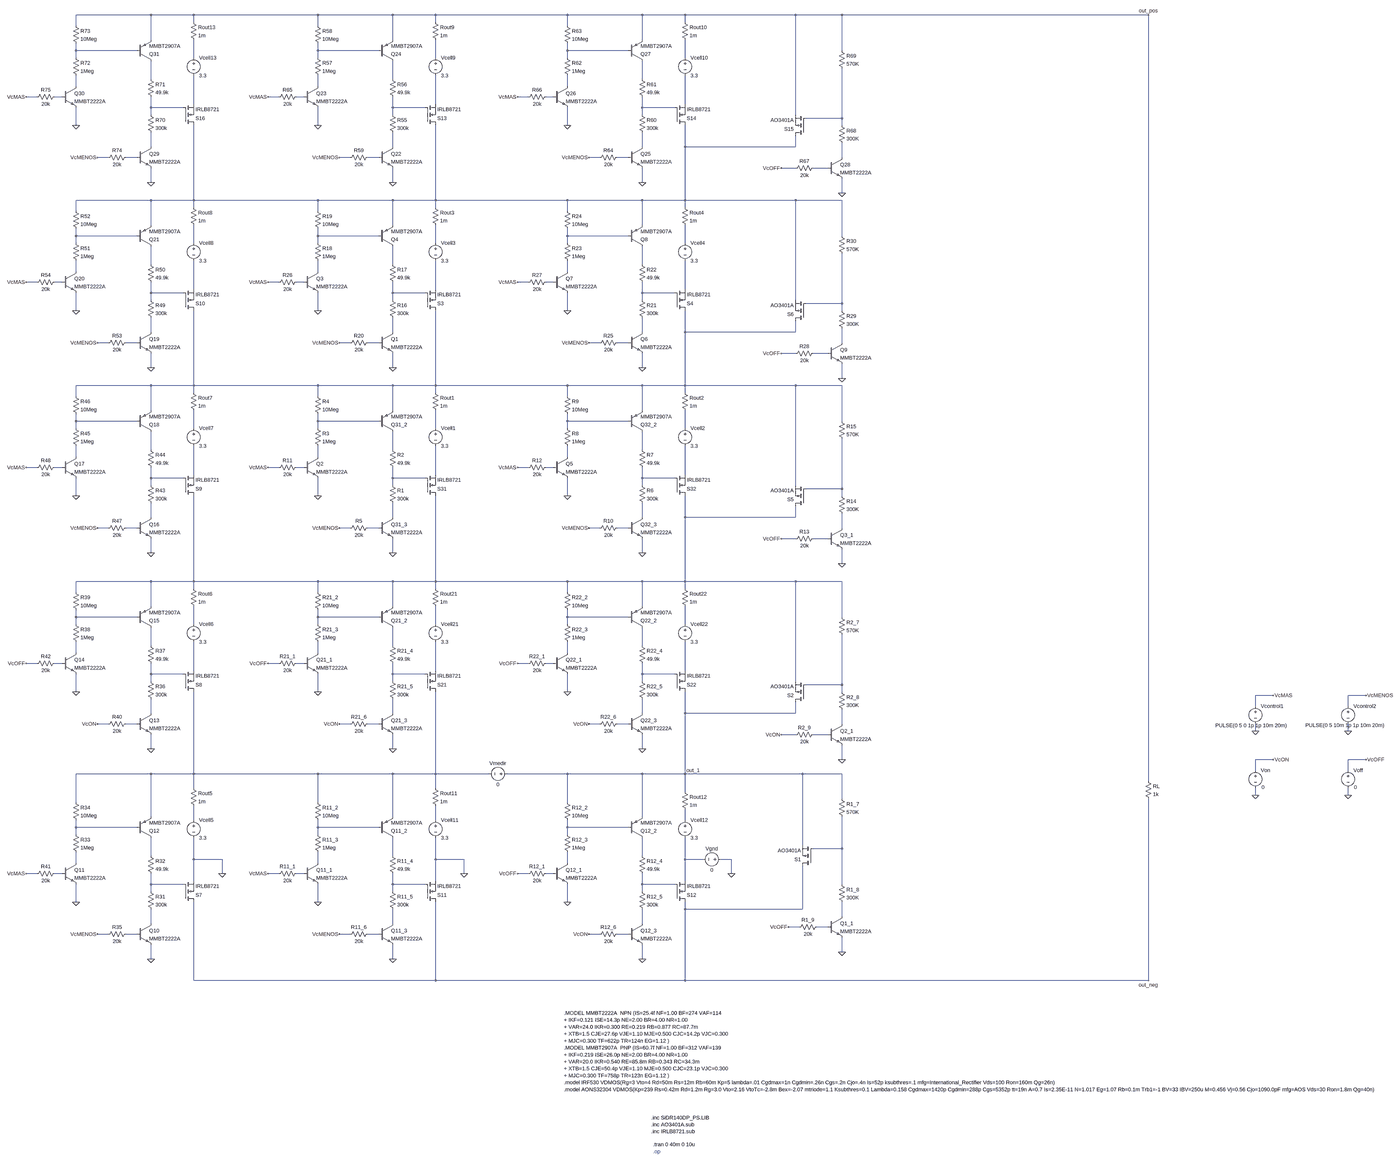
[diagram p0: schematic pruebas_de_cantidad.asc, whole sheet]
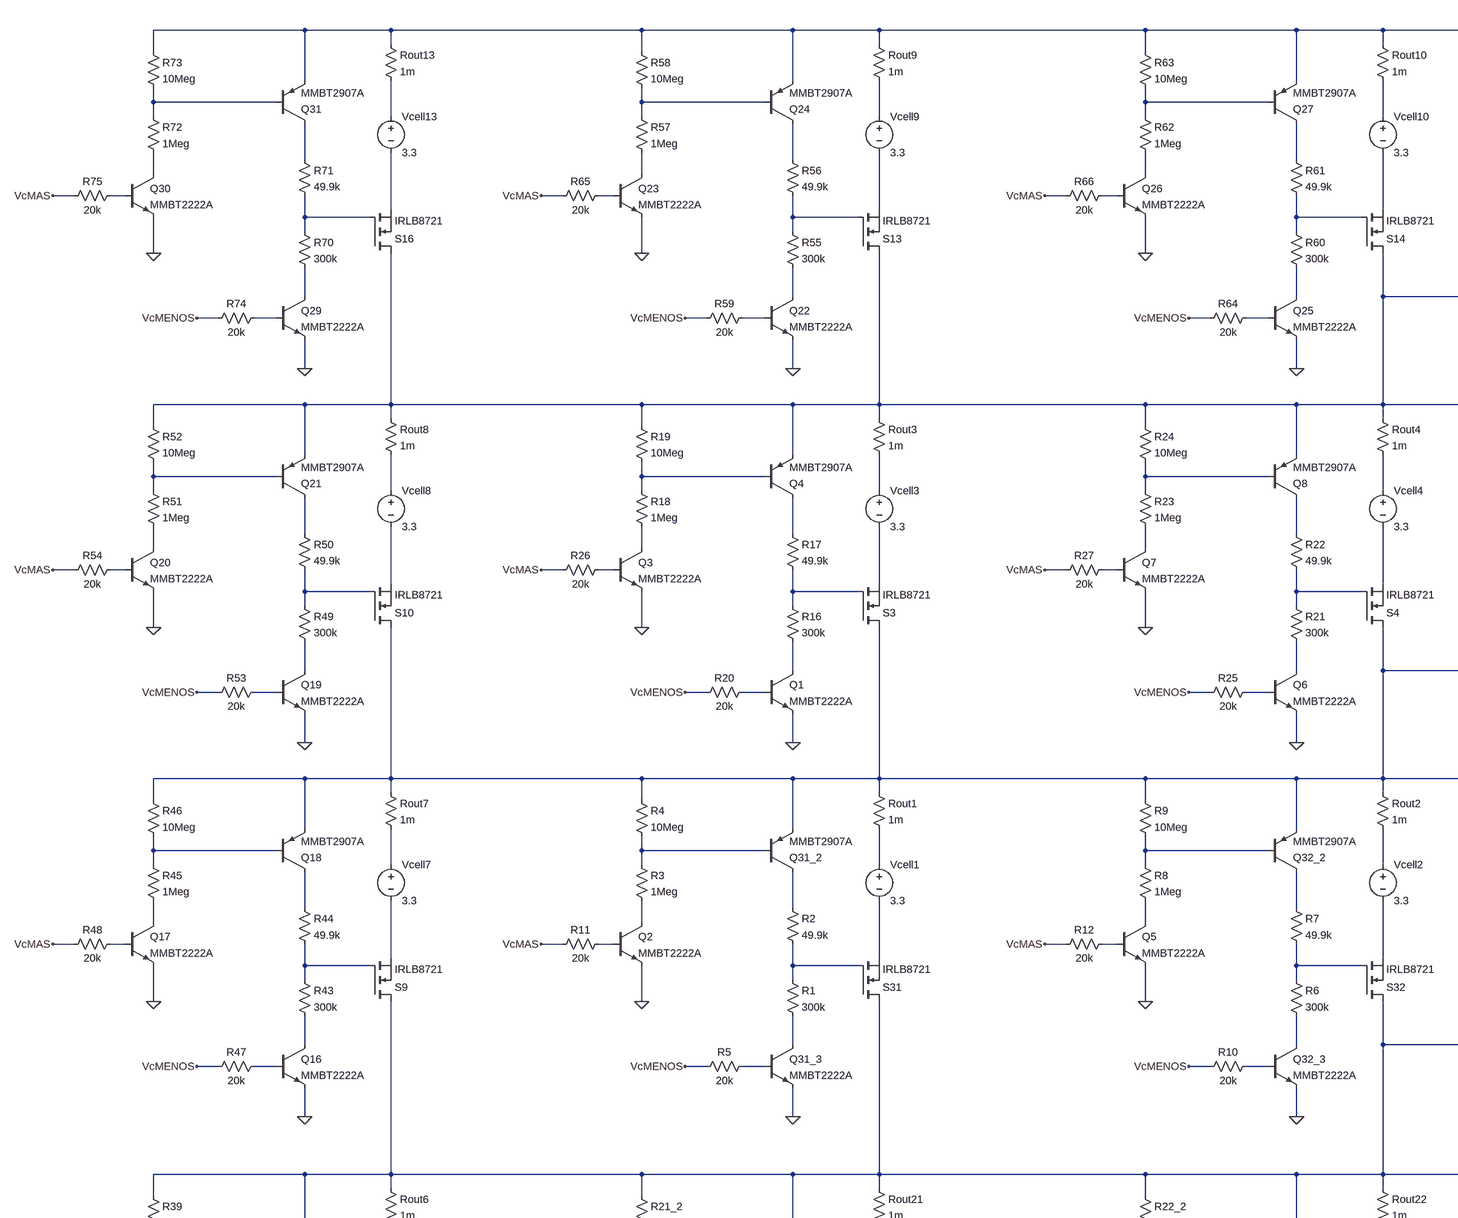
[diagram p1: schematic pruebas_de_cantidad.asc, part, row 1 of 2, column 1 of 2]
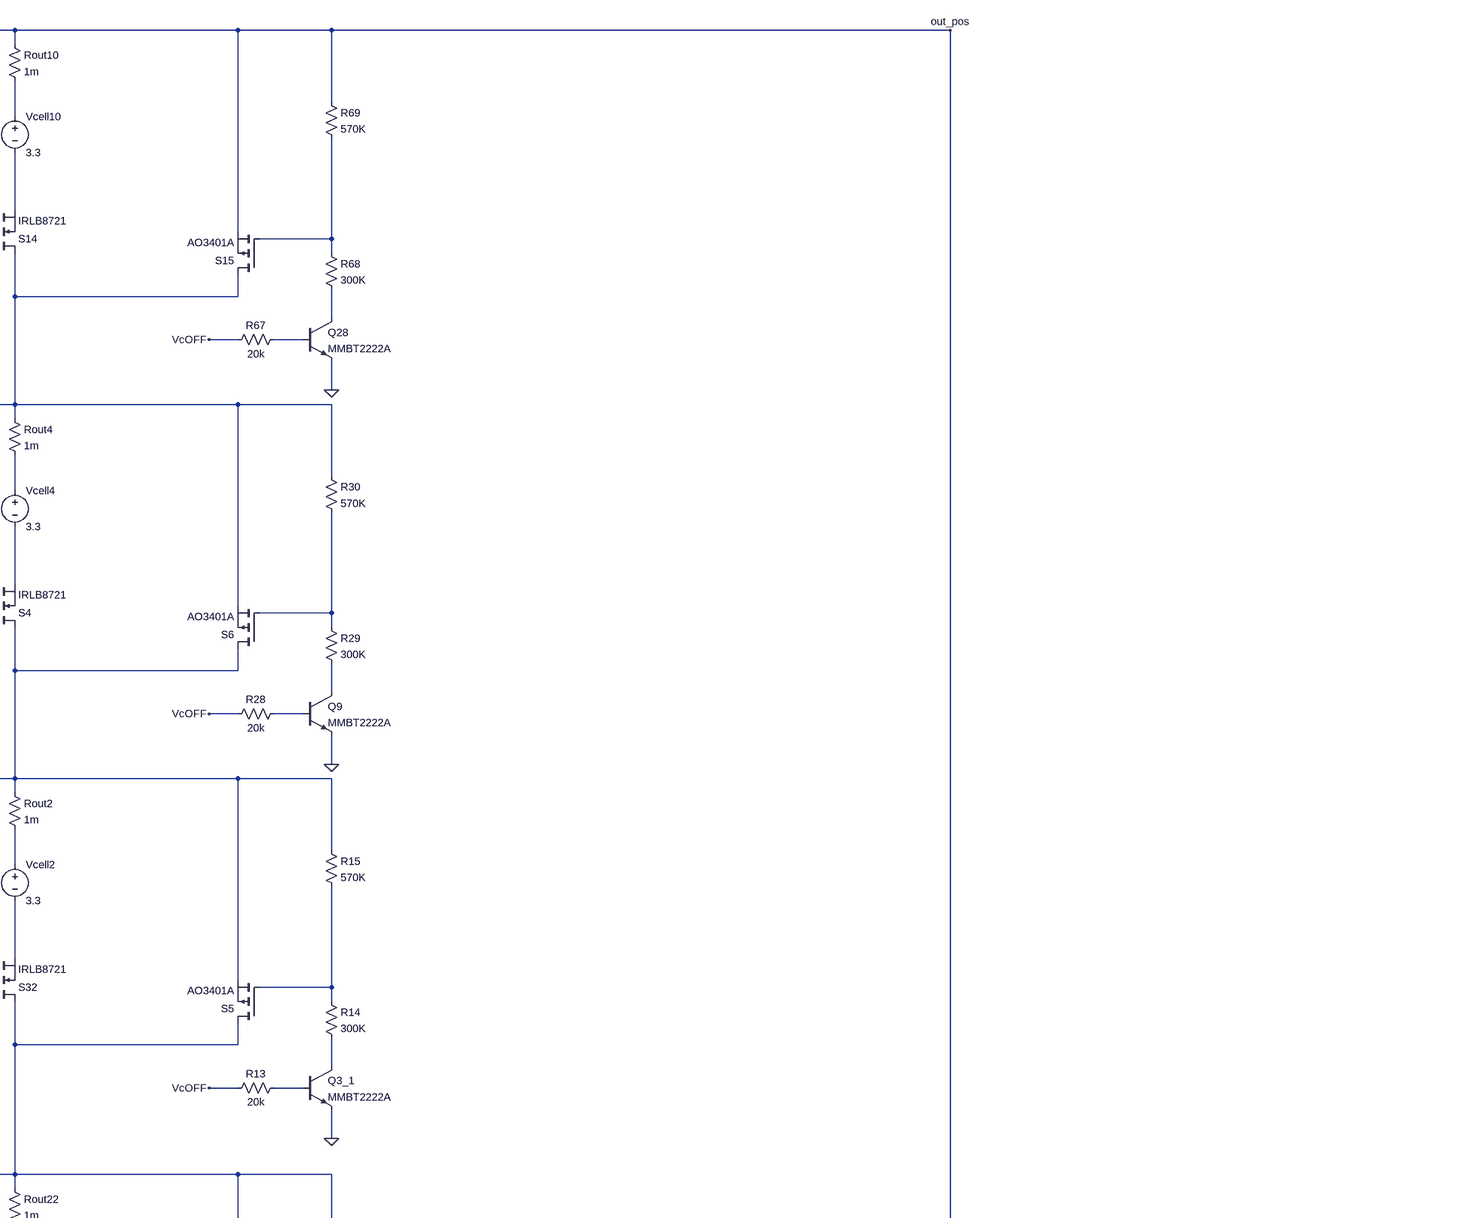
[diagram p2: schematic pruebas_de_cantidad.asc, part, row 1 of 2, column 2 of 2]
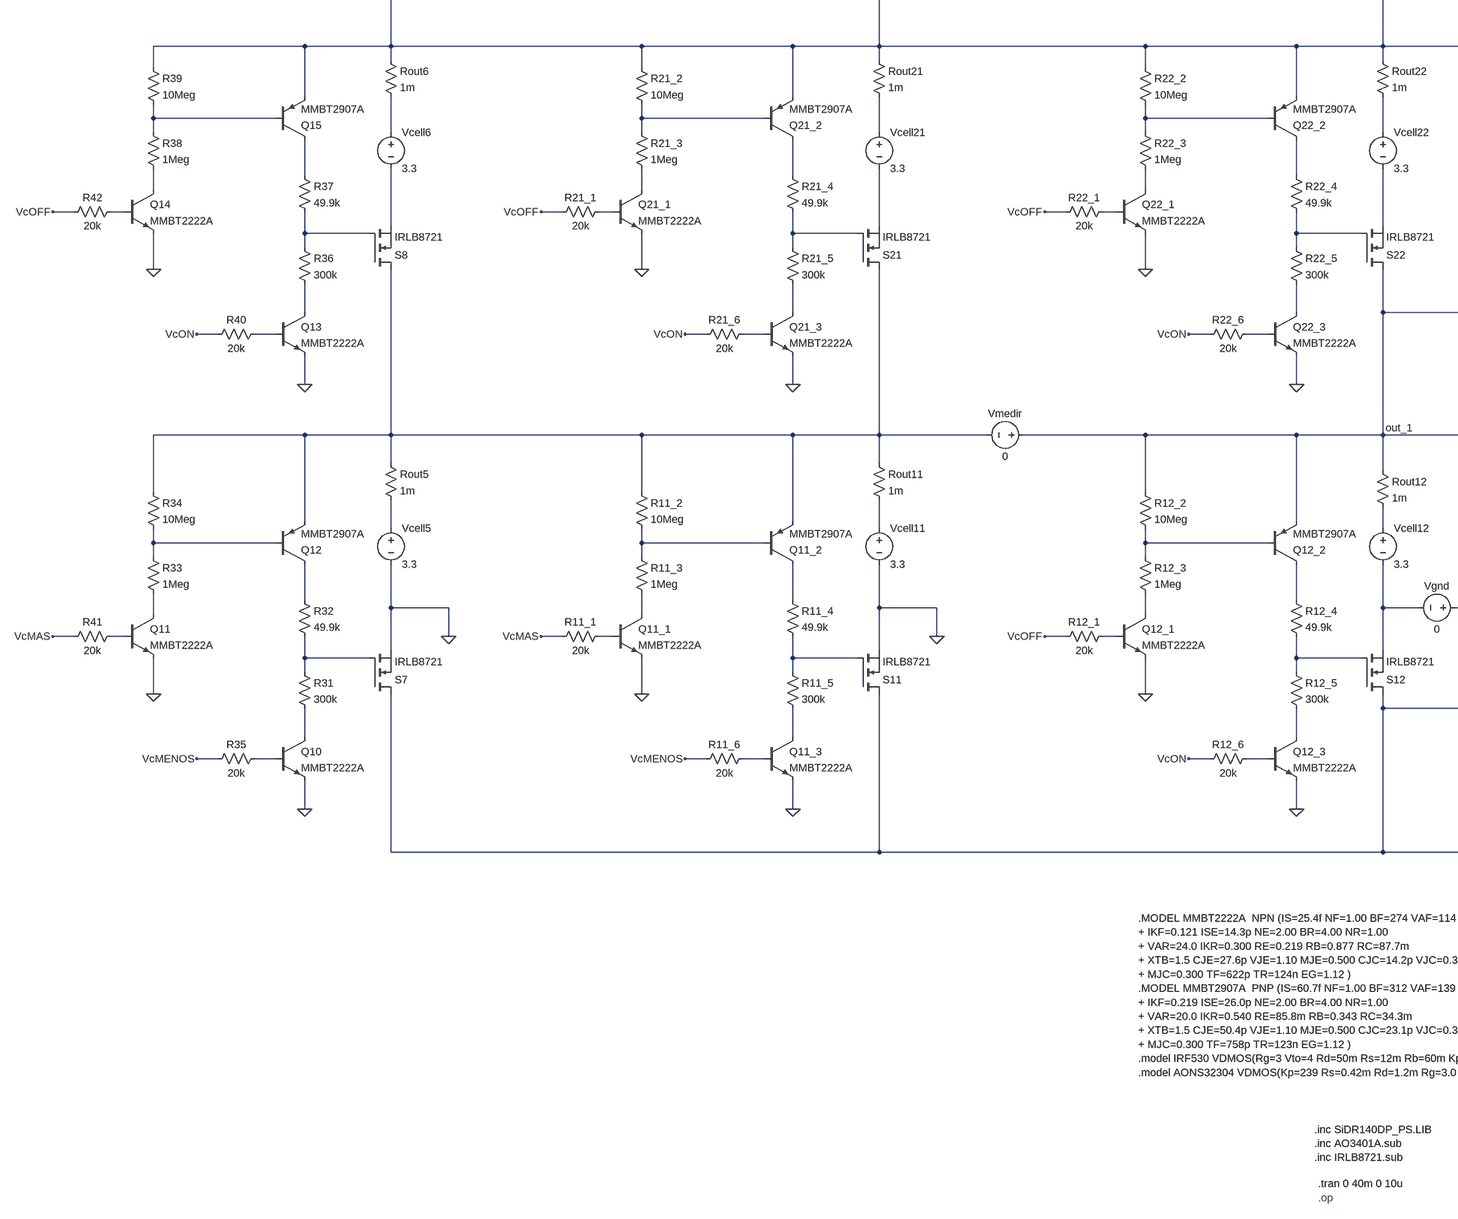
[diagram p3: schematic pruebas_de_cantidad.asc, part, row 2 of 2, column 1 of 2]
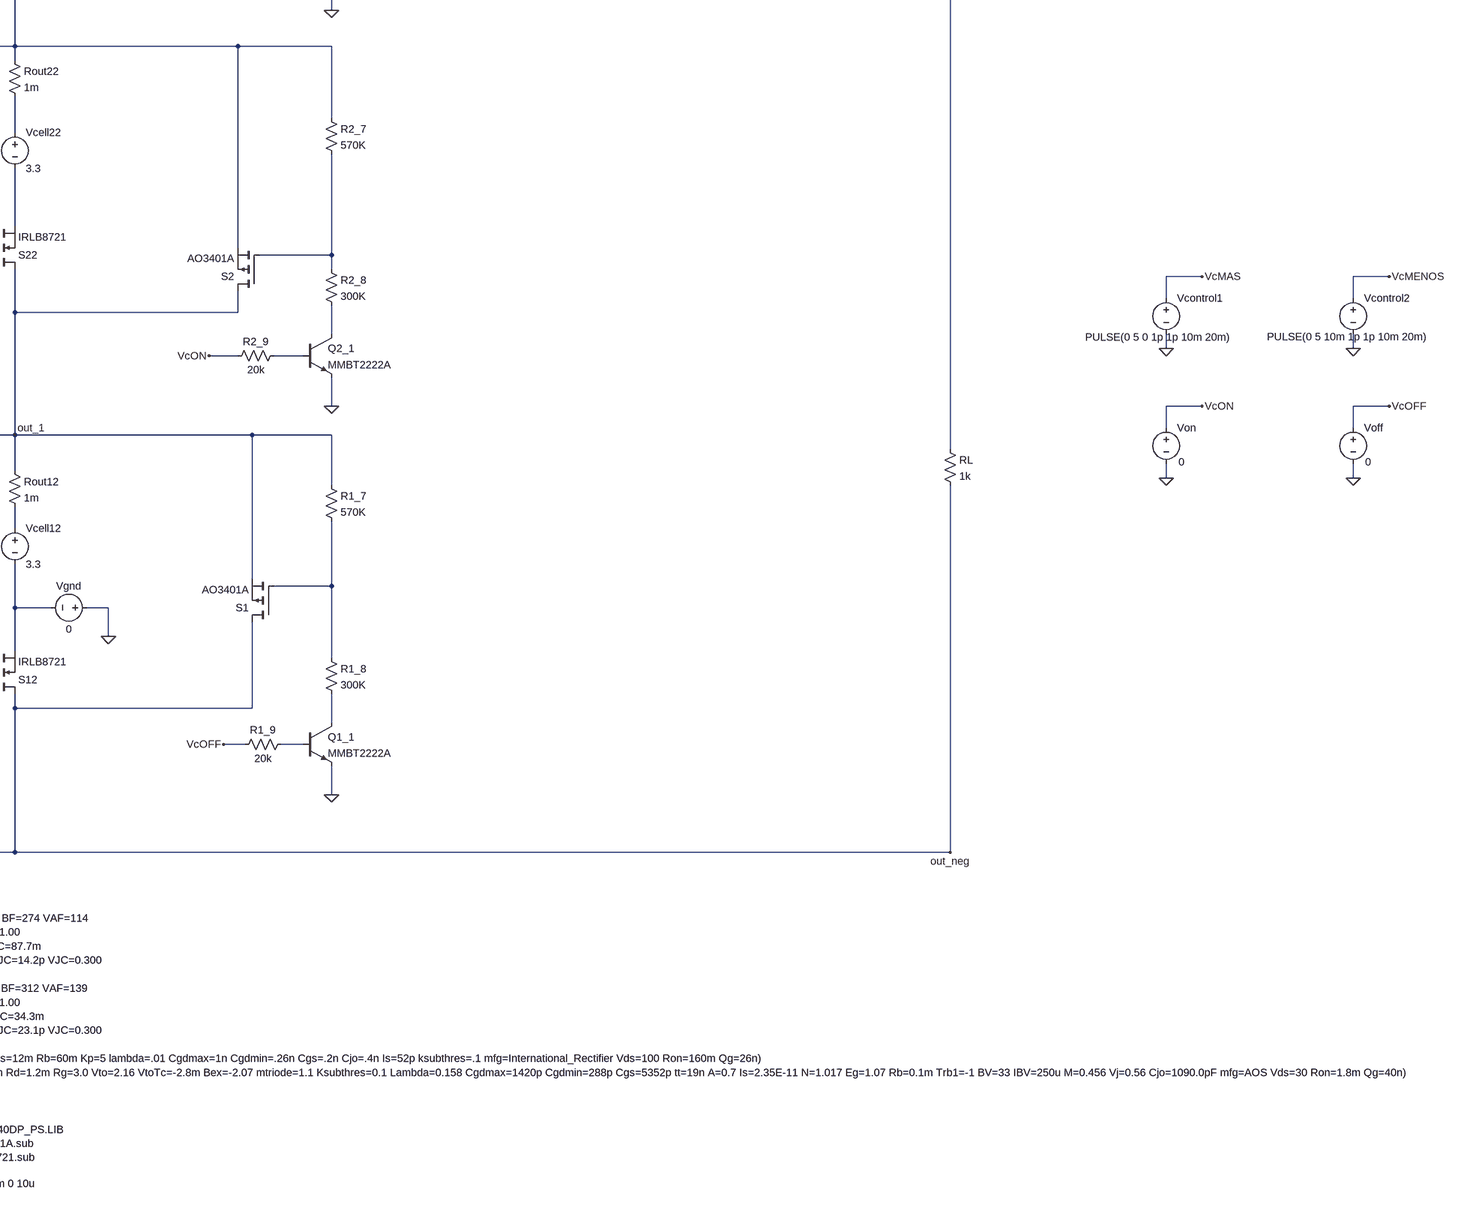
[diagram p4: schematic pruebas_de_cantidad.asc, part, row 2 of 2, column 2 of 2]
pruebas_de_cantidad.asc, the LTspice schematic file:
Version 4.1
SHEET 1 4156 1664
WIRE -1776 -3776 -2112 -3776
WIRE -1584 -3776 -1776 -3776
WIRE -928 -3776 -1584 -3776
WIRE -592 -3776 -928 -3776
WIRE -400 -3776 -592 -3776
WIRE 192 -3776 -400 -3776
WIRE 528 -3776 192 -3776
WIRE 720 -3776 528 -3776
WIRE 1216 -3776 720 -3776
WIRE 1424 -3776 1216 -3776
WIRE 2800 -3776 1424 -3776
WIRE -1584 -3744 -1584 -3776
WIRE -400 -3744 -400 -3776
WIRE 720 -3744 720 -3776
WIRE -2112 -3728 -2112 -3776
WIRE -928 -3728 -928 -3776
WIRE 192 -3728 192 -3776
WIRE -1776 -3664 -1776 -3776
WIRE -592 -3664 -592 -3776
WIRE 528 -3664 528 -3776
WIRE -2112 -3616 -2112 -3648
WIRE -1840 -3616 -2112 -3616
WIRE -928 -3616 -928 -3648
WIRE -656 -3616 -928 -3616
WIRE 192 -3616 192 -3648
WIRE 464 -3616 192 -3616
WIRE 1424 -3616 1424 -3776
WIRE -2112 -3584 -2112 -3616
WIRE -1584 -3584 -1584 -3664
WIRE -928 -3584 -928 -3616
WIRE -400 -3584 -400 -3664
WIRE 192 -3584 192 -3616
WIRE 720 -3584 720 -3664
WIRE -1776 -3488 -1776 -3568
WIRE -592 -3488 -592 -3568
WIRE 528 -3488 528 -3568
WIRE -2112 -3456 -2112 -3504
WIRE -928 -3456 -928 -3504
WIRE 192 -3456 192 -3504
WIRE -2288 -3408 -2336 -3408
WIRE -2176 -3408 -2208 -3408
WIRE -1104 -3408 -1152 -3408
WIRE -992 -3408 -1024 -3408
WIRE 16 -3408 -32 -3408
WIRE 128 -3408 96 -3408
WIRE -1584 -3376 -1584 -3504
WIRE -400 -3376 -400 -3504
WIRE 720 -3376 720 -3504
WIRE -1776 -3360 -1776 -3408
WIRE -1632 -3360 -1776 -3360
WIRE -592 -3360 -592 -3408
WIRE -448 -3360 -592 -3360
WIRE 528 -3360 528 -3408
WIRE 672 -3360 528 -3360
WIRE -1776 -3328 -1776 -3360
WIRE -592 -3328 -592 -3360
WIRE 528 -3328 528 -3360
WIRE 1216 -3328 1216 -3776
WIRE 1424 -3312 1424 -3536
WIRE 1424 -3312 1264 -3312
WIRE -2112 -3280 -2112 -3360
WIRE -928 -3280 -928 -3360
WIRE 192 -3280 192 -3360
WIRE 1424 -3280 1424 -3312
WIRE -1776 -3184 -1776 -3248
WIRE -592 -3184 -592 -3248
WIRE 528 -3184 528 -3248
WIRE 720 -3184 720 -3280
WIRE 1216 -3184 1216 -3232
WIRE 1216 -3184 720 -3184
WIRE -1968 -3136 -2016 -3136
WIRE -1840 -3136 -1888 -3136
WIRE -784 -3136 -832 -3136
WIRE -656 -3136 -704 -3136
WIRE 336 -3136 288 -3136
WIRE 464 -3136 416 -3136
WIRE 1424 -3136 1424 -3200
WIRE 1216 -3088 1152 -3088
WIRE 1360 -3088 1296 -3088
WIRE -1776 -3024 -1776 -3088
WIRE -592 -3024 -592 -3088
WIRE 528 -3024 528 -3088
WIRE 1424 -2976 1424 -3040
WIRE -1776 -2944 -2112 -2944
WIRE -1584 -2944 -1584 -3280
WIRE -1584 -2944 -1776 -2944
WIRE -928 -2944 -1584 -2944
WIRE -592 -2944 -928 -2944
WIRE -400 -2944 -400 -3280
WIRE -400 -2944 -592 -2944
WIRE 192 -2944 -400 -2944
WIRE 528 -2944 192 -2944
WIRE 720 -2944 720 -3184
WIRE 720 -2944 528 -2944
WIRE 1216 -2944 720 -2944
WIRE 1424 -2944 1216 -2944
WIRE -1584 -2912 -1584 -2944
WIRE -400 -2912 -400 -2944
WIRE 720 -2912 720 -2944
WIRE -2112 -2896 -2112 -2944
WIRE -928 -2896 -928 -2944
WIRE 192 -2896 192 -2944
WIRE -1776 -2832 -1776 -2944
WIRE -592 -2832 -592 -2944
WIRE 528 -2832 528 -2944
WIRE -2112 -2784 -2112 -2816
WIRE -1840 -2784 -2112 -2784
WIRE -928 -2784 -928 -2816
WIRE -656 -2784 -928 -2784
WIRE 192 -2784 192 -2816
WIRE 464 -2784 192 -2784
WIRE 1424 -2784 1424 -2944
WIRE -2112 -2752 -2112 -2784
WIRE -1584 -2752 -1584 -2832
WIRE -928 -2752 -928 -2784
WIRE -400 -2752 -400 -2832
WIRE 192 -2752 192 -2784
WIRE 720 -2752 720 -2832
WIRE -1776 -2656 -1776 -2736
WIRE -592 -2656 -592 -2736
WIRE 528 -2656 528 -2736
WIRE -2112 -2624 -2112 -2672
WIRE -928 -2624 -928 -2672
WIRE 192 -2624 192 -2672
WIRE -2288 -2576 -2336 -2576
WIRE -2176 -2576 -2208 -2576
WIRE -1104 -2576 -1152 -2576
WIRE -992 -2576 -1024 -2576
WIRE 16 -2576 -32 -2576
WIRE 128 -2576 96 -2576
WIRE -1584 -2544 -1584 -2672
WIRE -400 -2544 -400 -2672
WIRE 720 -2544 720 -2672
WIRE -1776 -2528 -1776 -2576
WIRE -1632 -2528 -1776 -2528
WIRE -592 -2528 -592 -2576
WIRE -448 -2528 -592 -2528
WIRE 528 -2528 528 -2576
WIRE 672 -2528 528 -2528
WIRE -1776 -2496 -1776 -2528
WIRE -592 -2496 -592 -2528
WIRE 528 -2496 528 -2528
WIRE 1216 -2496 1216 -2944
WIRE 1424 -2480 1424 -2704
WIRE 1424 -2480 1264 -2480
WIRE -2112 -2448 -2112 -2528
WIRE -928 -2448 -928 -2528
WIRE 192 -2448 192 -2528
WIRE 1424 -2448 1424 -2480
WIRE -1776 -2352 -1776 -2416
WIRE -592 -2352 -592 -2416
WIRE 528 -2352 528 -2416
WIRE 720 -2352 720 -2448
WIRE 1216 -2352 1216 -2400
WIRE 1216 -2352 720 -2352
WIRE -1968 -2304 -2016 -2304
WIRE -1840 -2304 -1888 -2304
WIRE -784 -2304 -832 -2304
WIRE -656 -2304 -704 -2304
WIRE 336 -2304 288 -2304
WIRE 464 -2304 416 -2304
WIRE 1424 -2304 1424 -2368
WIRE 1216 -2256 1152 -2256
WIRE 1360 -2256 1296 -2256
WIRE -1776 -2192 -1776 -2256
WIRE -592 -2192 -592 -2256
WIRE 528 -2192 528 -2256
WIRE 1424 -2144 1424 -2208
WIRE -1776 -2112 -2112 -2112
WIRE -1584 -2112 -1584 -2448
WIRE -1584 -2112 -1776 -2112
WIRE -928 -2112 -1584 -2112
WIRE -592 -2112 -928 -2112
WIRE -400 -2112 -400 -2448
WIRE -400 -2112 -592 -2112
WIRE 192 -2112 -400 -2112
WIRE 528 -2112 192 -2112
WIRE 720 -2112 720 -2352
WIRE 720 -2112 528 -2112
WIRE 1216 -2112 720 -2112
WIRE 1424 -2112 1216 -2112
WIRE -1584 -2080 -1584 -2112
WIRE -400 -2080 -400 -2112
WIRE 720 -2080 720 -2112
WIRE -2112 -2064 -2112 -2112
WIRE -928 -2064 -928 -2112
WIRE 192 -2064 192 -2112
WIRE -1776 -2000 -1776 -2112
WIRE -592 -2000 -592 -2112
WIRE 528 -2000 528 -2112
WIRE -2112 -1952 -2112 -1984
WIRE -1840 -1952 -2112 -1952
WIRE -928 -1952 -928 -1984
WIRE -656 -1952 -928 -1952
WIRE 192 -1952 192 -1984
WIRE 464 -1952 192 -1952
WIRE 1424 -1952 1424 -2112
WIRE -2112 -1920 -2112 -1952
WIRE -1584 -1920 -1584 -2000
WIRE -928 -1920 -928 -1952
WIRE -400 -1920 -400 -2000
WIRE 192 -1920 192 -1952
WIRE 720 -1920 720 -2000
WIRE -1776 -1824 -1776 -1904
WIRE -592 -1824 -592 -1904
WIRE 528 -1824 528 -1904
WIRE -2112 -1792 -2112 -1840
WIRE -928 -1792 -928 -1840
WIRE 192 -1792 192 -1840
WIRE -2288 -1744 -2336 -1744
WIRE -2176 -1744 -2208 -1744
WIRE -1104 -1744 -1152 -1744
WIRE -992 -1744 -1024 -1744
WIRE 16 -1744 -32 -1744
WIRE 128 -1744 96 -1744
WIRE -1584 -1712 -1584 -1840
WIRE -400 -1712 -400 -1840
WIRE 720 -1712 720 -1840
WIRE -1776 -1696 -1776 -1744
WIRE -1632 -1696 -1776 -1696
WIRE -592 -1696 -592 -1744
WIRE -448 -1696 -592 -1696
WIRE 528 -1696 528 -1744
WIRE 672 -1696 528 -1696
WIRE -1776 -1664 -1776 -1696
WIRE -592 -1664 -592 -1696
WIRE 528 -1664 528 -1696
WIRE 1216 -1664 1216 -2112
WIRE 1424 -1648 1424 -1872
WIRE 1424 -1648 1264 -1648
WIRE -2112 -1616 -2112 -1696
WIRE -928 -1616 -928 -1696
WIRE 192 -1616 192 -1696
WIRE 1424 -1616 1424 -1648
WIRE -1776 -1520 -1776 -1584
WIRE -592 -1520 -592 -1584
WIRE 528 -1520 528 -1584
WIRE 720 -1520 720 -1616
WIRE 1216 -1520 1216 -1568
WIRE 1216 -1520 720 -1520
WIRE -1968 -1472 -2016 -1472
WIRE -1840 -1472 -1888 -1472
WIRE -784 -1472 -832 -1472
WIRE -656 -1472 -704 -1472
WIRE 336 -1472 288 -1472
WIRE 464 -1472 416 -1472
WIRE 1424 -1472 1424 -1536
WIRE 1216 -1424 1152 -1424
WIRE 1360 -1424 1296 -1424
WIRE -1776 -1360 -1776 -1424
WIRE -592 -1360 -592 -1424
WIRE 528 -1360 528 -1424
WIRE 1424 -1312 1424 -1376
WIRE -1776 -1232 -2112 -1232
WIRE -1584 -1232 -1584 -1616
WIRE -1584 -1232 -1776 -1232
WIRE -928 -1232 -1584 -1232
WIRE -592 -1232 -928 -1232
WIRE -400 -1232 -400 -1616
WIRE -400 -1232 -592 -1232
WIRE 192 -1232 -400 -1232
WIRE 528 -1232 192 -1232
WIRE 720 -1232 720 -1520
WIRE 720 -1232 528 -1232
WIRE 1216 -1232 720 -1232
WIRE 1424 -1232 1216 -1232
WIRE -1584 -1200 -1584 -1232
WIRE -400 -1200 -400 -1232
WIRE 720 -1200 720 -1232
WIRE -2112 -1184 -2112 -1232
WIRE -928 -1184 -928 -1232
WIRE 192 -1184 192 -1232
WIRE -1776 -1120 -1776 -1232
WIRE -592 -1120 -592 -1232
WIRE 528 -1120 528 -1232
WIRE -2112 -1072 -2112 -1104
WIRE -1840 -1072 -2112 -1072
WIRE -928 -1072 -928 -1104
WIRE -656 -1072 -928 -1072
WIRE 192 -1072 192 -1104
WIRE 464 -1072 192 -1072
WIRE 1424 -1072 1424 -1232
WIRE -2112 -1040 -2112 -1072
WIRE -1584 -1040 -1584 -1120
WIRE -928 -1040 -928 -1072
WIRE -400 -1040 -400 -1120
WIRE 192 -1040 192 -1072
WIRE 720 -1040 720 -1120
WIRE -1776 -944 -1776 -1024
WIRE -592 -944 -592 -1024
WIRE 528 -944 528 -1024
WIRE -2112 -912 -2112 -960
WIRE -928 -912 -928 -960
WIRE 192 -912 192 -960
WIRE -2288 -864 -2336 -864
WIRE -2176 -864 -2208 -864
WIRE -1104 -864 -1152 -864
WIRE -992 -864 -1024 -864
WIRE 16 -864 -32 -864
WIRE 128 -864 96 -864
WIRE -1584 -832 -1584 -960
WIRE -400 -832 -400 -960
WIRE 720 -832 720 -960
WIRE -1776 -816 -1776 -864
WIRE -1632 -816 -1776 -816
WIRE -592 -816 -592 -864
WIRE -448 -816 -592 -816
WIRE 528 -816 528 -864
WIRE 672 -816 528 -816
WIRE -1776 -784 -1776 -816
WIRE -592 -784 -592 -816
WIRE 528 -784 528 -816
WIRE 1216 -784 1216 -1232
WIRE 1424 -768 1424 -992
WIRE 1424 -768 1264 -768
WIRE -2112 -736 -2112 -816
WIRE -928 -736 -928 -816
WIRE 192 -736 192 -816
WIRE 1424 -736 1424 -768
WIRE 3360 -720 3280 -720
WIRE 3776 -720 3696 -720
WIRE 3280 -672 3280 -720
WIRE 3696 -672 3696 -720
WIRE -1776 -640 -1776 -704
WIRE -592 -640 -592 -704
WIRE 528 -640 528 -704
WIRE 720 -640 720 -736
WIRE 1216 -640 1216 -688
WIRE 1216 -640 720 -640
WIRE -1968 -592 -2016 -592
WIRE -1840 -592 -1888 -592
WIRE -784 -592 -832 -592
WIRE -656 -592 -704 -592
WIRE 336 -592 288 -592
WIRE 464 -592 416 -592
WIRE 1424 -592 1424 -656
WIRE 3280 -560 3280 -592
WIRE 3696 -560 3696 -592
WIRE 1216 -544 1152 -544
WIRE 1360 -544 1296 -544
WIRE -1776 -480 -1776 -544
WIRE -592 -480 -592 -544
WIRE 528 -480 528 -544
WIRE 1424 -432 1424 -496
WIRE 3360 -432 3280 -432
WIRE 3776 -432 3696 -432
WIRE 3280 -384 3280 -432
WIRE 3696 -384 3696 -432
WIRE -1776 -368 -2112 -368
WIRE -1584 -368 -1584 -736
WIRE -1584 -368 -1776 -368
WIRE -928 -368 -1584 -368
WIRE -592 -368 -928 -368
WIRE -400 -368 -400 -736
WIRE -400 -368 -592 -368
WIRE -160 -368 -400 -368
WIRE 192 -368 -80 -368
WIRE 528 -368 192 -368
WIRE 720 -368 720 -640
WIRE 720 -368 528 -368
WIRE 1248 -368 720 -368
WIRE 1424 -368 1248 -368
WIRE 2800 -336 2800 -3776
WIRE -1584 -304 -1584 -368
WIRE -400 -304 -400 -368
WIRE 720 -288 720 -368
WIRE 3280 -272 3280 -304
WIRE 3696 -272 3696 -304
WIRE 1424 -256 1424 -368
WIRE -2112 -240 -2112 -368
WIRE -928 -240 -928 -368
WIRE 192 -240 192 -368
WIRE -1776 -176 -1776 -368
WIRE -592 -176 -592 -368
WIRE 528 -176 528 -368
WIRE -1584 -160 -1584 -224
WIRE -400 -160 -400 -224
WIRE 720 -160 720 -208
WIRE -2112 -128 -2112 -160
WIRE -1840 -128 -2112 -128
WIRE -928 -128 -928 -160
WIRE -656 -128 -928 -128
WIRE 192 -128 192 -160
WIRE 464 -128 192 -128
WIRE -2112 -96 -2112 -128
WIRE -928 -96 -928 -128
WIRE 192 -96 192 -128
WIRE 1248 -48 1248 -368
WIRE 1424 -32 1424 -176
WIRE 1424 -32 1296 -32
WIRE -1776 0 -1776 -80
WIRE -592 0 -592 -80
WIRE 528 0 528 -80
WIRE -1584 16 -1584 -80
WIRE -1456 16 -1584 16
WIRE -400 16 -400 -80
WIRE -272 16 -400 16
WIRE 720 16 720 -80
WIRE 800 16 720 16
WIRE 928 16 880 16
WIRE -2112 32 -2112 -16
WIRE -928 32 -928 -16
WIRE 192 32 192 -16
WIRE -2288 80 -2336 80
WIRE -2176 80 -2208 80
WIRE -1456 80 -1456 16
WIRE -1104 80 -1152 80
WIRE -992 80 -1024 80
WIRE -272 80 -272 16
WIRE 16 80 -32 80
WIRE 128 80 96 80
WIRE 928 80 928 16
WIRE -1584 112 -1584 16
WIRE -400 112 -400 16
WIRE 720 112 720 16
WIRE -1776 128 -1776 80
WIRE -1632 128 -1776 128
WIRE -592 128 -592 80
WIRE -448 128 -592 128
WIRE 528 128 528 80
WIRE 672 128 528 128
WIRE 1424 128 1424 -32
WIRE -1776 160 -1776 128
WIRE -592 160 -592 128
WIRE 528 160 528 128
WIRE -2112 208 -2112 128
WIRE -928 208 -928 128
WIRE 192 208 192 128
WIRE 720 240 720 208
WIRE 1248 240 1248 48
WIRE 1248 240 720 240
WIRE 1424 272 1424 208
WIRE -1776 304 -1776 240
WIRE -592 304 -592 240
WIRE 528 304 528 240
WIRE 1232 320 1184 320
WIRE 1360 320 1312 320
WIRE -1968 352 -2016 352
WIRE -1840 352 -1888 352
WIRE -784 352 -832 352
WIRE -656 352 -704 352
WIRE 336 352 288 352
WIRE 464 352 416 352
WIRE 1424 432 1424 368
WIRE -1776 464 -1776 400
WIRE -592 464 -592 400
WIRE 528 464 528 400
WIRE -1584 560 -1584 208
WIRE -400 560 -400 208
WIRE -400 560 -1584 560
WIRE 720 560 720 240
WIRE 720 560 -400 560
WIRE 2800 560 2800 -256
WIRE 2800 560 720 560
FLAG -928 208 0
FLAG -592 464 0
FLAG -272 80 0
FLAG 192 208 0
FLAG 528 464 0
FLAG 928 80 0
FLAG -928 -736 0
FLAG -592 -480 0
FLAG 192 -736 0
FLAG 528 -480 0
FLAG 3280 -560 0
FLAG 3696 -560 0
FLAG 3360 -720 VcMAS
FLAG 3776 -720 VcMENOS
FLAG 3696 -272 0
FLAG 3776 -432 VcOFF
FLAG 3280 -272 0
FLAG 3360 -432 VcON
FLAG -832 352 VcMENOS
FLAG -832 -592 VcON
FLAG 288 -592 VcON
FLAG 288 352 VcON
FLAG -1152 80 VcMAS
FLAG -1152 -864 VcOFF
FLAG -32 -864 VcOFF
FLAG -32 80 VcOFF
FLAG 2800 560 out_neg
FLAG 720 -368 out_1
FLAG 1424 432 0
FLAG 1184 320 VcOFF
FLAG 1424 -432 0
FLAG 1152 -544 VcON
FLAG -928 -1616 0
FLAG -592 -1360 0
FLAG 192 -1616 0
FLAG 528 -1360 0
FLAG -832 -1472 VcMENOS
FLAG 288 -1472 VcMENOS
FLAG -1152 -1744 VcMAS
FLAG -32 -1744 VcMAS
FLAG 1424 -1312 0
FLAG 1152 -1424 VcOFF
FLAG -928 -2448 0
FLAG -592 -2192 0
FLAG 192 -2448 0
FLAG 528 -2192 0
FLAG -832 -2304 VcMENOS
FLAG 288 -2304 VcMENOS
FLAG -1152 -2576 VcMAS
FLAG -32 -2576 VcMAS
FLAG 1424 -2144 0
FLAG 1152 -2256 VcOFF
FLAG -2112 208 0
FLAG -1776 464 0
FLAG -1456 80 0
FLAG -2112 -736 0
FLAG -1776 -480 0
FLAG -2016 352 VcMENOS
FLAG -2016 -592 VcON
FLAG -2336 80 VcMAS
FLAG -2336 -864 VcOFF
FLAG -2112 -1616 0
FLAG -1776 -1360 0
FLAG -2016 -1472 VcMENOS
FLAG -2336 -1744 VcMAS
FLAG -2112 -2448 0
FLAG -1776 -2192 0
FLAG -2016 -2304 VcMENOS
FLAG -2336 -2576 VcMAS
FLAG 2800 -3776 out_pos
FLAG -928 -3280 0
FLAG -592 -3024 0
FLAG 192 -3280 0
FLAG 528 -3024 0
FLAG -832 -3136 VcMENOS
FLAG 288 -3136 VcMENOS
FLAG -1152 -3408 VcMAS
FLAG -32 -3408 VcMAS
FLAG 1424 -2976 0
FLAG 1152 -3088 VcOFF
FLAG -2112 -3280 0
FLAG -1776 -3024 0
FLAG -2016 -3136 VcMENOS
FLAG -2336 -3408 VcMAS
SYMBOL npn -656 304 R0
SYMATTR InstName Q11_3
SYMATTR Value MMBT2222A
SYMBOL res -608 144 R0
SYMATTR InstName R11_5
SYMATTR Value 300k
SYMBOL res -608 -16 R0
SYMATTR InstName R11_4
SYMATTR Value 49.9k
SYMBOL npn -992 32 R0
SYMATTR InstName Q11_1
SYMATTR Value MMBT2222A
SYMBOL res -944 -112 R0
SYMATTR InstName R11_3
SYMATTR Value 1Meg
SYMBOL res -944 -256 R0
SYMATTR InstName R11_2
SYMATTR Value 10Meg
SYMBOL res -688 336 R90
WINDOW 0 0 56 VBottom 2
WINDOW 3 32 56 VTop 2
SYMATTR InstName R11_6
SYMATTR Value 20k
SYMBOL voltage -400 -176 R0
WINDOW 123 0 0 Left 0
WINDOW 39 0 0 Left 0
SYMATTR InstName Vcell11
SYMATTR Value 3.3
SYMBOL pnp -656 -80 M180
SYMATTR InstName Q11_2
SYMATTR Value MMBT2907A
SYMBOL nmos -448 208 M180
SYMATTR InstName S11
SYMATTR Value IRLB8721
SYMATTR Prefix x
SYMBOL npn 464 304 R0
SYMATTR InstName Q12_3
SYMATTR Value MMBT2222A
SYMBOL res 512 144 R0
SYMATTR InstName R12_5
SYMATTR Value 300k
SYMBOL res 512 -16 R0
SYMATTR InstName R12_4
SYMATTR Value 49.9k
SYMBOL npn 128 32 R0
SYMATTR InstName Q12_1
SYMATTR Value MMBT2222A
SYMBOL res 176 -112 R0
SYMATTR InstName R12_3
SYMATTR Value 1Meg
SYMBOL res 176 -256 R0
SYMATTR InstName R12_2
SYMATTR Value 10Meg
SYMBOL res 432 336 R90
WINDOW 0 0 56 VBottom 2
WINDOW 3 32 56 VTop 2
SYMATTR InstName R12_6
SYMATTR Value 20k
SYMBOL voltage 720 -176 R0
WINDOW 123 0 0 Left 0
WINDOW 39 0 0 Left 0
SYMATTR InstName Vcell12
SYMATTR Value 3.3
SYMBOL pnp 464 -80 M180
SYMATTR InstName Q12_2
SYMATTR Value MMBT2907A
SYMBOL nmos 672 208 M180
SYMATTR InstName S12
SYMATTR Value IRLB8721
SYMATTR Prefix X
SYMBOL npn -656 -640 R0
SYMATTR InstName Q21_3
SYMATTR Value MMBT2222A
SYMBOL res -608 -800 R0
SYMATTR InstName R21_5
SYMATTR Value 300k
SYMBOL res -608 -960 R0
SYMATTR InstName R21_4
SYMATTR Value 49.9k
SYMBOL npn -992 -912 R0
SYMATTR InstName Q21_1
SYMATTR Value MMBT2222A
SYMBOL res -944 -1056 R0
SYMATTR InstName R21_3
SYMATTR Value 1Meg
SYMBOL res -944 -1200 R0
SYMATTR InstName R21_2
SYMATTR Value 10Meg
SYMBOL res -688 -608 R90
WINDOW 0 0 56 VBottom 2
WINDOW 3 32 56 VTop 2
SYMATTR InstName R21_6
SYMATTR Value 20k
SYMBOL voltage -400 -1056 R0
WINDOW 123 0 0 Left 0
WINDOW 39 0 0 Left 0
SYMATTR InstName Vcell21
SYMATTR Value 3.3
SYMBOL pnp -656 -1024 M180
SYMATTR InstName Q21_2
SYMATTR Value MMBT2907A
SYMBOL nmos -448 -736 M180
SYMATTR InstName S21
SYMATTR Value IRLB8721
SYMATTR Prefix X
SYMBOL npn 464 -640 R0
SYMATTR InstName Q22_3
SYMATTR Value MMBT2222A
SYMBOL res 512 -800 R0
SYMATTR InstName R22_5
SYMATTR Value 300k
SYMBOL res 512 -960 R0
SYMATTR InstName R22_4
SYMATTR Value 49.9k
SYMBOL npn 128 -912 R0
SYMATTR InstName Q22_1
SYMATTR Value MMBT2222A
SYMBOL res 176 -1056 R0
SYMATTR InstName R22_3
SYMATTR Value 1Meg
SYMBOL res 176 -1200 R0
SYMATTR InstName R22_2
SYMATTR Value 10Meg
SYMBOL res 432 -608 R90
WINDOW 0 0 56 VBottom 2
WINDOW 3 32 56 VTop 2
SYMATTR InstName R22_6
SYMATTR Value 20k
SYMBOL voltage 720 -1056 R0
WINDOW 123 0 0 Left 0
WINDOW 39 0 0 Left 0
SYMATTR InstName Vcell22
SYMATTR Value 3.3
SYMBOL pnp 464 -1024 M180
SYMATTR InstName Q22_2
SYMATTR Value MMBT2907A
SYMBOL nmos 672 -736 M180
SYMATTR InstName S22
SYMATTR Value IRLB8721
SYMATTR Prefix X
SYMBOL voltage 3280 -688 R0
WINDOW 3 -180 103 Left 2
WINDOW 123 0 0 Left 0
WINDOW 39 0 0 Left 0
SYMATTR Value PULSE(0 5 0 1p 1p 10m 20m)
SYMATTR InstName Vcontrol1
SYMBOL voltage 3696 -688 R0
WINDOW 3 -192 102 Left 2
WINDOW 123 0 0 Left 0
WINDOW 39 0 0 Left 0
SYMATTR Value PULSE(0 5 10m 1p 1p 10m 20m)
SYMATTR InstName Vcontrol2
SYMBOL voltage 3696 -400 R0
WINDOW 3 27 92 Left 2
WINDOW 123 0 0 Left 0
WINDOW 39 0 0 Left 0
SYMATTR Value 0
SYMATTR InstName Voff
SYMBOL voltage 3280 -400 R0
WINDOW 3 28 92 Left 2
WINDOW 123 0 0 Left 0
WINDOW 39 0 0 Left 0
SYMATTR Value 0
SYMATTR InstName Von
SYMBOL res -1008 64 R90
WINDOW 0 0 56 VBottom 2
WINDOW 3 32 56 VTop 2
SYMATTR InstName R11_1
SYMATTR Value 20k
SYMBOL res -1008 -880 R90
WINDOW 0 0 56 VBottom 2
WINDOW 3 32 56 VTop 2
SYMATTR InstName R21_1
SYMATTR Value 20k
SYMBOL res 112 -880 R90
WINDOW 0 0 56 VBottom 2
WINDOW 3 32 56 VTop 2
SYMATTR InstName R22_1
SYMATTR Value 20k
SYMBOL res 112 64 R90
WINDOW 0 0 56 VBottom 2
WINDOW 3 32 56 VTop 2
SYMATTR InstName R12_1
SYMATTR Value 20k
SYMBOL res 2784 -352 R0
SYMATTR InstName RL
SYMATTR Value 1k
SYMBOL res 704 -304 R0
SYMATTR InstName Rout12
SYMATTR Value 1m
SYMBOL res -416 -320 R0
SYMATTR InstName Rout11
SYMATTR Value 1m
SYMBOL res -416 -1216 R0
SYMATTR InstName Rout21
SYMATTR Value 1m
SYMBOL res 704 -1216 R0
SYMATTR InstName Rout22
SYMATTR Value 1m
SYMBOL voltage -64 -368 R90
WINDOW 0 -32 56 VBottom 2
WINDOW 3 32 56 VTop 2
WINDOW 123 0 0 Left 0
WINDOW 39 0 0 Left 0
SYMATTR InstName Vmedir
SYMATTR Value 0
SYMBOL voltage 896 16 R90
WINDOW 0 -32 56 VBottom 2
WINDOW 3 32 56 VTop 2
WINDOW 123 0 0 Left 0
WINDOW 39 0 0 Left 0
SYMATTR InstName Vgnd
SYMATTR Value 0
SYMBOL npn 1360 272 R0
SYMATTR InstName Q1_1
SYMATTR Value MMBT2222A
SYMBOL res 1328 304 R90
WINDOW 0 0 56 VBottom 2
WINDOW 3 32 56 VTop 2
SYMATTR InstName R1_9
SYMATTR Value 20k
SYMBOL res 1408 112 R0
SYMATTR InstName R1_8
SYMATTR Value 300K
SYMBOL res 1408 -272 R0
SYMATTR InstName R1_7
SYMATTR Value 570K
SYMBOL npn 1360 -592 R0
SYMATTR InstName Q2_1
SYMATTR Value MMBT2222A
SYMBOL res 1312 -560 R90
WINDOW 0 0 56 VBottom 2
WINDOW 3 32 56 VTop 2
SYMATTR InstName R2_9
SYMATTR Value 20k
SYMBOL res 1408 -752 R0
SYMATTR InstName R2_8
SYMATTR Value 300K
SYMBOL res 1408 -1088 R0
SYMATTR InstName R2_7
SYMATTR Value 570K
SYMBOL pmos 1296 48 R180
SYMATTR InstName S1
SYMATTR Value AO3401A
SYMATTR Prefix X
SYMBOL pmos 1264 -688 R180
SYMATTR InstName S2
SYMATTR Value AO3401A
SYMATTR Prefix X
SYMBOL npn -656 -1520 R0
SYMATTR InstName Q31_3
SYMATTR Value MMBT2222A
SYMBOL res -608 -1680 R0
SYMATTR InstName R1
SYMATTR Value 300k
SYMBOL res -608 -1840 R0
SYMATTR InstName R2
SYMATTR Value 49.9k
SYMBOL npn -992 -1792 R0
SYMATTR InstName Q2
SYMATTR Value MMBT2222A
SYMBOL res -944 -1936 R0
SYMATTR InstName R3
SYMATTR Value 1Meg
SYMBOL res -944 -2080 R0
SYMATTR InstName R4
SYMATTR Value 10Meg
SYMBOL res -688 -1488 R90
WINDOW 0 0 56 VBottom 2
WINDOW 3 32 56 VTop 2
SYMATTR InstName R5
SYMATTR Value 20k
SYMBOL voltage -400 -1936 R0
WINDOW 123 0 0 Left 0
WINDOW 39 0 0 Left 0
SYMATTR InstName Vcell1
SYMATTR Value 3.3
SYMBOL pnp -656 -1904 M180
SYMATTR InstName Q31_2
SYMATTR Value MMBT2907A
SYMBOL nmos -448 -1616 M180
SYMATTR InstName S31
SYMATTR Value IRLB8721
SYMATTR Prefix X
SYMBOL npn 464 -1520 R0
SYMATTR InstName Q32_3
SYMATTR Value MMBT2222A
SYMBOL res 512 -1680 R0
SYMATTR InstName R6
SYMATTR Value 300k
SYMBOL res 512 -1840 R0
SYMATTR InstName R7
SYMATTR Value 49.9k
SYMBOL npn 128 -1792 R0
SYMATTR InstName Q5
SYMATTR Value MMBT2222A
SYMBOL res 176 -1936 R0
SYMATTR InstName R8
SYMATTR Value 1Meg
SYMBOL res 176 -2080 R0
SYMATTR InstName R9
SYMATTR Value 10Meg
SYMBOL res 432 -1488 R90
WINDOW 0 0 56 VBottom 2
WINDOW 3 32 56 VTop 2
SYMATTR InstName R10
SYMATTR Value 20k
SYMBOL voltage 720 -1936 R0
WINDOW 123 0 0 Left 0
WINDOW 39 0 0 Left 0
SYMATTR InstName Vcell2
SYMATTR Value 3.3
SYMBOL pnp 464 -1904 M180
SYMATTR InstName Q32_2
SYMATTR Value MMBT2907A
SYMBOL nmos 672 -1616 M180
SYMATTR InstName S32
SYMATTR Value IRLB8721
SYMATTR Prefix X
SYMBOL res -1008 -1760 R90
WINDOW 0 0 56 VBottom 2
WINDOW 3 32 56 VTop 2
SYMATTR InstName R11
SYMATTR Value 20k
SYMBOL res 112 -1760 R90
WINDOW 0 0 56 VBottom 2
WINDOW 3 32 56 VTop 2
SYMATTR InstName R12
SYMATTR Value 20k
SYMBOL res -416 -2096 R0
SYMATTR InstName Rout1
SYMATTR Value 1m
SYMBOL res 704 -2096 R0
SYMATTR InstName Rout2
SYMATTR Value 1m
SYMBOL npn 1360 -1472 R0
SYMATTR InstName Q3_1
SYMATTR Value MMBT2222A
SYMBOL res 1312 -1440 R90
WINDOW 0 0 56 VBottom 2
WINDOW 3 32 56 VTop 2
SYMATTR InstName R13
SYMATTR Value 20k
SYMBOL res 1408 -1632 R0
SYMATTR InstName R14
SYMATTR Value 300K
SYMBOL res 1408 -1968 R0
SYMATTR InstName R15
SYMATTR Value 570K
SYMBOL pmos 1264 -1568 R180
SYMATTR InstName S5
SYMATTR Value AO3401A
SYMATTR Prefix X
SYMBOL npn -656 -2352 R0
SYMATTR InstName Q1
SYMATTR Value MMBT2222A
SYMBOL res -608 -2512 R0
SYMATTR InstName R16
SYMATTR Value 300k
SYMBOL res -608 -2672 R0
SYMATTR InstName R17
SYMATTR Value 49.9k
SYMBOL npn -992 -2624 R0
SYMATTR InstName Q3
SYMATTR Value MMBT2222A
SYMBOL res -944 -2768 R0
SYMATTR InstName R18
SYMATTR Value 1Meg
SYMBOL res -944 -2912 R0
SYMATTR InstName R19
SYMATTR Value 10Meg
SYMBOL res -688 -2320 R90
WINDOW 0 0 56 VBottom 2
WINDOW 3 32 56 VTop 2
SYMATTR InstName R20
SYMATTR Value 20k
SYMBOL voltage -400 -2768 R0
WINDOW 123 0 0 Left 0
WINDOW 39 0 0 Left 0
SYMATTR InstName Vcell3
SYMATTR Value 3.3
SYMBOL pnp -656 -2736 M180
SYMATTR InstName Q4
SYMATTR Value MMBT2907A
SYMBOL nmos -448 -2448 M180
SYMATTR InstName S3
SYMATTR Value IRLB8721
SYMATTR Prefix X
SYMBOL npn 464 -2352 R0
SYMATTR InstName Q6
SYMATTR Value MMBT2222A
SYMBOL res 512 -2512 R0
SYMATTR InstName R21
SYMATTR Value 300k
SYMBOL res 512 -2672 R0
SYMATTR InstName R22
SYMATTR Value 49.9k
SYMBOL npn 128 -2624 R0
SYMATTR InstName Q7
SYMATTR Value MMBT2222A
SYMBOL res 176 -2768 R0
SYMATTR InstName R23
SYMATTR Value 1Meg
SYMBOL res 176 -2912 R0
SYMATTR InstName R24
SYMATTR Value 10Meg
SYMBOL res 432 -2320 R90
WINDOW 0 0 56 VBottom 2
WINDOW 3 32 56 VTop 2
SYMATTR InstName R25
SYMATTR Value 20k
SYMBOL voltage 720 -2768 R0
WINDOW 123 0 0 Left 0
WINDOW 39 0 0 Left 0
SYMATTR InstName Vcell4
SYMATTR Value 3.3
SYMBOL pnp 464 -2736 M180
SYMATTR InstName Q8
SYMATTR Value MMBT2907A
SYMBOL nmos 672 -2448 M180
SYMATTR InstName S4
SYMATTR Value IRLB8721
SYMATTR Prefix X
SYMBOL res -1008 -2592 R90
WINDOW 0 0 56 VBottom 2
WINDOW 3 32 56 VTop 2
SYMATTR InstName R26
SYMATTR Value 20k
SYMBOL res 112 -2592 R90
WINDOW 0 0 56 VBottom 2
WINDOW 3 32 56 VTop 2
SYMATTR InstName R27
SYMATTR Value 20k
SYMBOL res -416 -2928 R0
SYMATTR InstName Rout3
SYMATTR Value 1m
SYMBOL res 704 -2928 R0
SYMATTR InstName Rout4
SYMATTR Value 1m
SYMBOL npn 1360 -2304 R0
SYMATTR InstName Q9
SYMATTR Value MMBT2222A
SYMBOL res 1312 -2272 R90
WINDOW 0 0 56 VBottom 2
WINDOW 3 32 56 VTop 2
SYMATTR InstName R28
SYMATTR Value 20k
SYMBOL res 1408 -2464 R0
SYMATTR InstName R29
SYMATTR Value 300K
SYMBOL res 1408 -2800 R0
SYMATTR InstName R30
SYMATTR Value 570K
SYMBOL pmos 1264 -2400 R180
SYMATTR InstName S6
SYMATTR Value AO3401A
SYMATTR Prefix X
SYMBOL npn -1840 304 R0
SYMATTR InstName Q10
SYMATTR Value MMBT2222A
SYMBOL res -1792 144 R0
SYMATTR InstName R31
SYMATTR Value 300k
SYMBOL res -1792 -16 R0
SYMATTR InstName R32
SYMATTR Value 49.9k
SYMBOL npn -2176 32 R0
SYMATTR InstName Q11
SYMATTR Value MMBT2222A
SYMBOL res -2128 -112 R0
SYMATTR InstName R33
SYMATTR Value 1Meg
SYMBOL res -2128 -256 R0
SYMATTR InstName R34
SYMATTR Value 10Meg
SYMBOL res -1872 336 R90
WINDOW 0 0 56 VBottom 2
WINDOW 3 32 56 VTop 2
SYMATTR InstName R35
SYMATTR Value 20k
SYMBOL voltage -1584 -176 R0
WINDOW 123 0 0 Left 0
WINDOW 39 0 0 Left 0
SYMATTR InstName Vcell5
SYMATTR Value 3.3
SYMBOL pnp -1840 -80 M180
SYMATTR InstName Q12
SYMATTR Value MMBT2907A
SYMBOL nmos -1632 208 M180
SYMATTR InstName S7
SYMATTR Value IRLB8721
SYMATTR Prefix x
SYMBOL npn -1840 -640 R0
SYMATTR InstName Q13
SYMATTR Value MMBT2222A
SYMBOL res -1792 -800 R0
SYMATTR InstName R36
SYMATTR Value 300k
SYMBOL res -1792 -960 R0
SYMATTR InstName R37
SYMATTR Value 49.9k
SYMBOL npn -2176 -912 R0
SYMATTR InstName Q14
SYMATTR Value MMBT2222A
SYMBOL res -2128 -1056 R0
SYMATTR InstName R38
SYMATTR Value 1Meg
SYMBOL res -2128 -1200 R0
SYMATTR InstName R39
SYMATTR Value 10Meg
SYMBOL res -1872 -608 R90
WINDOW 0 0 56 VBottom 2
WINDOW 3 32 56 VTop 2
SYMATTR InstName R40
SYMATTR Value 20k
SYMBOL voltage -1584 -1056 R0
WINDOW 123 0 0 Left 0
WINDOW 39 0 0 Left 0
SYMATTR InstName Vcell6
SYMATTR Value 3.3
SYMBOL pnp -1840 -1024 M180
SYMATTR InstName Q15
SYMATTR Value MMBT2907A
SYMBOL nmos -1632 -736 M180
SYMATTR InstName S8
SYMATTR Value IRLB8721
SYMATTR Prefix X
SYMBOL res -2192 64 R90
WINDOW 0 0 56 VBottom 2
WINDOW 3 32 56 VTop 2
SYMATTR InstName R41
SYMATTR Value 20k
SYMBOL res -2192 -880 R90
WINDOW 0 0 56 VBottom 2
WINDOW 3 32 56 VTop 2
SYMATTR InstName R42
SYMATTR Value 20k
SYMBOL res -1600 -320 R0
SYMATTR InstName Rout5
SYMATTR Value 1m
SYMBOL res -1600 -1216 R0
SYMATTR InstName Rout6
SYMATTR Value 1m
SYMBOL npn -1840 -1520 R0
SYMATTR InstName Q16
SYMATTR Value MMBT2222A
SYMBOL res -1792 -1680 R0
SYMATTR InstName R43
SYMATTR Value 300k
SYMBOL res -1792 -1840 R0
SYMATTR InstName R44
SYMATTR Value 49.9k
SYMBOL npn -2176 -1792 R0
SYMATTR InstName Q17
SYMATTR Value MMBT2222A
SYMBOL res -2128 -1936 R0
SYMATTR InstName R45
SYMATTR Value 1Meg
SYMBOL res -2128 -2080 R0
SYMATTR InstName R46
SYMATTR Value 10Meg
SYMBOL res -1872 -1488 R90
WINDOW 0 0 56 VBottom 2
WINDOW 3 32 56 VTop 2
SYMATTR InstName R47
SYMATTR Value 20k
SYMBOL voltage -1584 -1936 R0
WINDOW 123 0 0 Left 0
WINDOW 39 0 0 Left 0
SYMATTR InstName Vcell7
SYMATTR Value 3.3
SYMBOL pnp -1840 -1904 M180
SYMATTR InstName Q18
SYMATTR Value MMBT2907A
SYMBOL nmos -1632 -1616 M180
SYMATTR InstName S9
SYMATTR Value IRLB8721
SYMATTR Prefix X
SYMBOL res -2192 -1760 R90
WINDOW 0 0 56 VBottom 2
WINDOW 3 32 56 VTop 2
SYMATTR InstName R48
SYMATTR Value 20k
SYMBOL res -1600 -2096 R0
SYMATTR InstName Rout7
SYMATTR Value 1m
SYMBOL npn -1840 -2352 R0
SYMATTR InstName Q19
SYMATTR Value MMBT2222A
SYMBOL res -1792 -2512 R0
SYMATTR InstName R49
SYMATTR Value 300k
SYMBOL res -1792 -2672 R0
SYMATTR InstName R50
SYMATTR Value 49.9k
SYMBOL npn -2176 -2624 R0
SYMATTR InstName Q20
SYMATTR Value MMBT2222A
SYMBOL res -2128 -2768 R0
SYMATTR InstName R51
SYMATTR Value 1Meg
SYMBOL res -2128 -2912 R0
SYMATTR InstName R52
SYMATTR Value 10Meg
SYMBOL res -1872 -2320 R90
WINDOW 0 0 56 VBottom 2
WINDOW 3 32 56 VTop 2
SYMATTR InstName R53
SYMATTR Value 20k
SYMBOL voltage -1584 -2768 R0
WINDOW 123 0 0 Left 0
WINDOW 39 0 0 Left 0
SYMATTR InstName Vcell8
SYMATTR Value 3.3
SYMBOL pnp -1840 -2736 M180
SYMATTR InstName Q21
SYMATTR Value MMBT2907A
SYMBOL nmos -1632 -2448 M180
SYMATTR InstName S10
SYMATTR Value IRLB8721
SYMATTR Prefix X
SYMBOL res -2192 -2592 R90
WINDOW 0 0 56 VBottom 2
WINDOW 3 32 56 VTop 2
SYMATTR InstName R54
SYMATTR Value 20k
SYMBOL res -1600 -2928 R0
SYMATTR InstName Rout8
SYMATTR Value 1m
SYMBOL npn -656 -3184 R0
SYMATTR InstName Q22
SYMATTR Value MMBT2222A
SYMBOL res -608 -3344 R0
SYMATTR InstName R55
SYMATTR Value 300k
SYMBOL res -608 -3504 R0
SYMATTR InstName R56
SYMATTR Value 49.9k
SYMBOL npn -992 -3456 R0
SYMATTR InstName Q23
SYMATTR Value MMBT2222A
SYMBOL res -944 -3600 R0
SYMATTR InstName R57
SYMATTR Value 1Meg
SYMBOL res -944 -3744 R0
SYMATTR InstName R58
SYMATTR Value 10Meg
SYMBOL res -688 -3152 R90
WINDOW 0 0 56 VBottom 2
WINDOW 3 32 56 VTop 2
SYMATTR InstName R59
SYMATTR Value 20k
SYMBOL voltage -400 -3600 R0
WINDOW 123 0 0 Left 0
WINDOW 39 0 0 Left 0
SYMATTR InstName Vcell9
SYMATTR Value 3.3
SYMBOL pnp -656 -3568 M180
SYMATTR InstName Q24
SYMATTR Value MMBT2907A
SYMBOL nmos -448 -3280 M180
SYMATTR InstName S13
SYMATTR Value IRLB8721
SYMATTR Prefix X
SYMBOL npn 464 -3184 R0
SYMATTR InstName Q25
SYMATTR Value MMBT2222A
SYMBOL res 512 -3344 R0
SYMATTR InstName R60
SYMATTR Value 300k
SYMBOL res 512 -3504 R0
SYMATTR InstName R61
SYMATTR Value 49.9k
SYMBOL npn 128 -3456 R0
SYMATTR InstName Q26
SYMATTR Value MMBT2222A
SYMBOL res 176 -3600 R0
SYMATTR InstName R62
SYMATTR Value 1Meg
SYMBOL res 176 -3744 R0
SYMATTR InstName R63
SYMATTR Value 10Meg
SYMBOL res 432 -3152 R90
WINDOW 0 0 56 VBottom 2
WINDOW 3 32 56 VTop 2
SYMATTR InstName R64
SYMATTR Value 20k
SYMBOL voltage 720 -3600 R0
WINDOW 123 0 0 Left 0
WINDOW 39 0 0 Left 0
SYMATTR InstName Vcell10
SYMATTR Value 3.3
SYMBOL pnp 464 -3568 M180
SYMATTR InstName Q27
SYMATTR Value MMBT2907A
SYMBOL nmos 672 -3280 M180
SYMATTR InstName S14
SYMATTR Value IRLB8721
SYMATTR Prefix X
SYMBOL res -1008 -3424 R90
WINDOW 0 0 56 VBottom 2
WINDOW 3 32 56 VTop 2
SYMATTR InstName R65
SYMATTR Value 20k
SYMBOL res 112 -3424 R90
WINDOW 0 0 56 VBottom 2
WINDOW 3 32 56 VTop 2
SYMATTR InstName R66
SYMATTR Value 20k
SYMBOL res -416 -3760 R0
SYMATTR InstName Rout9
SYMATTR Value 1m
SYMBOL res 704 -3760 R0
SYMATTR InstName Rout10
SYMATTR Value 1m
SYMBOL npn 1360 -3136 R0
SYMATTR InstName Q28
SYMATTR Value MMBT2222A
SYMBOL res 1312 -3104 R90
WINDOW 0 0 56 VBottom 2
WINDOW 3 32 56 VTop 2
SYMATTR InstName R67
SYMATTR Value 20k
SYMBOL res 1408 -3296 R0
SYMATTR InstName R68
SYMATTR Value 300K
SYMBOL res 1408 -3632 R0
SYMATTR InstName R69
SYMATTR Value 570K
SYMBOL pmos 1264 -3232 R180
SYMATTR InstName S15
SYMATTR Value AO3401A
SYMATTR Prefix X
SYMBOL npn -1840 -3184 R0
SYMATTR InstName Q29
SYMATTR Value MMBT2222A
SYMBOL res -1792 -3344 R0
SYMATTR InstName R70
SYMATTR Value 300k
SYMBOL res -1792 -3504 R0
SYMATTR InstName R71
SYMATTR Value 49.9k
SYMBOL npn -2176 -3456 R0
SYMATTR InstName Q30
SYMATTR Value MMBT2222A
SYMBOL res -2128 -3600 R0
SYMATTR InstName R72
SYMATTR Value 1Meg
SYMBOL res -2128 -3744 R0
SYMATTR InstName R73
SYMATTR Value 10Meg
SYMBOL res -1872 -3152 R90
WINDOW 0 0 56 VBottom 2
WINDOW 3 32 56 VTop 2
SYMATTR InstName R74
SYMATTR Value 20k
SYMBOL voltage -1584 -3600 R0
WINDOW 123 0 0 Left 0
WINDOW 39 0 0 Left 0
SYMATTR InstName Vcell13
SYMATTR Value 3.3
SYMBOL pnp -1840 -3568 M180
SYMATTR InstName Q31
SYMATTR Value MMBT2907A
SYMBOL nmos -1632 -3280 M180
SYMATTR InstName S16
SYMATTR Value IRLB8721
SYMATTR Prefix X
SYMBOL res -2192 -3424 R90
WINDOW 0 0 56 VBottom 2
WINDOW 3 32 56 VTop 2
SYMATTR InstName R75
SYMATTR Value 20k
SYMBOL res -1600 -3760 R0
SYMATTR InstName Rout13
SYMATTR Value 1m
TEXT 576 1616 Left 2 !.tran 0 40m 0 10u
TEXT 176 968 Left 2 !.MODEL MMBT2222A  NPN (IS=25.4f NF=1.00 BF=274 VAF=114 \n+ IKF=0.121 ISE=14.3p NE=2.00 BR=4.00 NR=1.00 \n+ VAR=24.0 IKR=0.300 RE=0.219 RB=0.877 RC=87.7m \n+ XTB=1.5 CJE=27.6p VJE=1.10 MJE=0.500 CJC=14.2p VJC=0.300 \n+ MJC=0.300 TF=622p TR=124n EG=1.12 )\n.MODEL MMBT2907A  PNP (IS=60.7f NF=1.00 BF=312 VAF=139 \n+ IKF=0.219 ISE=26.0p NE=2.00 BR=4.00 NR=1.00 \n+ VAR=20.0 IKR=0.540 RE=85.8m RB=0.343 RC=34.3m \n+ XTB=1.5 CJE=50.4p VJE=1.10 MJE=0.500 CJC=23.1p VJC=0.300 \n+ MJC=0.300 TF=758p TR=123n EG=1.12 )\n.model IRF530 VDMOS(Rg=3 Vto=4 Rd=50m Rs=12m Rb=60m Kp=5 lambda=.01 Cgdmax=1n Cgdmin=.26n Cgs=.2n Cjo=.4n Is=52p ksubthres=.1 mfg=International_Rectifier Vds=100 Ron=160m Qg=26n)\n.model AONS32304 VDMOS(Kp=239 Rs=0.42m Rd=1.2m Rg=3.0 Vto=2.16 VtoTc=-2.8m Bex=-2.07 mtriode=1.1 Ksubthres=0.1 Lambda=0.158 Cgdmax=1420p Cgdmin=288p Cgs=5352p tt=19n A=0.7 Is=2.35E-11 N=1.017 Eg=1.07 Rb=0.1m Trb1=-1 BV=33 IBV=250u M=0.456 Vj=0.56 Cjo=1090.0pF mfg=AOS Vds=30 Ron=1.8m Qg=40n)
TEXT 568 1496 Left 2 !.inc SiDR140DP_PS.LIB\n.inc AO3401A.sub\n.inc IRLB8721.sub
TEXT 576 1648 Left 2 ;.op

The netlist it stands for:
* pruebas_de_cantidad.asc
Q11_3 N147 N151 0 0 MMBT2222A
R11_5 N143 N147 300k
R11_4 N133 N143 49.9k
Q11_1 N137 N140 0 0 MMBT2222A
R11_3 N129 N137 1Meg
R11_2 N124 N129 10Meg
R11_6 N151 VcMENOS 20k
Vcell11 N126 0 3.3
Q11_2 N133 N129 N124 0 MMBT2907A
X§S11 out_neg N143 0 IRLB8721  ; pins D G S
Q12_3 N148 N152 0 0 MMBT2222A
R12_5 N144 N148 300k
R12_4 N134 N144 49.9k
Q12_1 N138 N141 0 0 MMBT2222A
R12_3 N130 N138 1Meg
R12_2 out_1 N130 10Meg
R12_6 N152 VcON 20k
Vcell12 N127 N135 3.3
Q12_2 N134 N130 out_1 0 MMBT2907A
X§S12 out_neg N144 N135 IRLB8721  ; pins D G S
Q21_3 N117 N120 0 0 MMBT2222A
R21_5 N113 N117 300k
R21_4 N101 N113 49.9k
Q21_1 N104 N107 0 0 MMBT2222A
R21_3 N095 N104 1Meg
R21_2 N088 N095 10Meg
R21_6 N120 VcON 20k
Vcell21 N098 N110 3.3
Q21_2 N101 N095 N088 0 MMBT2907A
X§S21 N124 N113 N110 IRLB8721  ; pins D G S
Q22_3 N118 N121 0 0 MMBT2222A
R22_5 N114 N118 300k
R22_4 N102 N114 49.9k
Q22_1 N105 N108 0 0 MMBT2222A
R22_3 N096 N105 1Meg
R22_2 N088 N096 10Meg
R22_6 N121 VcON 20k
Vcell22 N099 N111 3.3
Q22_2 N102 N096 N088 0 MMBT2907A
X§S22 out_1 N114 N111 IRLB8721  ; pins D G S
Vcontrol1 VcMAS 0 PULSE(0 5 0 1p 1p 10m 20m)
Vcontrol2 VcMENOS 0 PULSE(0 5 10m 1p 1p 10m 20m)
Voff VcOFF 0 0
Von VcON 0 0
R11_1 N140 VcMAS 20k
R21_1 N107 VcOFF 20k
R22_1 N108 VcOFF 20k
R12_1 N141 VcOFF 20k
RL out_pos out_neg 1k
Rout12 out_1 N127 1m
Rout11 N124 N126 1m
Rout21 N088 N098 1m
Rout22 N088 N099 1m
Vmedir out_1 N124 0
Vgnd 0 N135 0
Q1_1 N145 N149 0 0 MMBT2222A
R1_9 N149 VcOFF 20k
R1_8 N131 N145 300K
R1_7 out_1 N131 570K
Q2_1 N122 N123 0 0 MMBT2222A
R2_9 N123 VcON 20k
R2_8 N115 N122 300K
R2_7 N088 N115 570K
X§S1 out_neg N131 out_1 AO3401A  ; pins D G S
X§S2 out_1 N115 N088 AO3401A  ; pins D G S
Q31_3 N086 N090 0 0 MMBT2222A
R1 N082 N086 300k
R2 N070 N082 49.9k
Q2 N073 N076 0 0 MMBT2222A
R3 N064 N073 1Meg
R4 N057 N064 10Meg
R5 N090 VcMENOS 20k
Vcell1 N067 N079 3.3
Q31_2 N070 N064 N057 0 MMBT2907A
X§S31 N088 N082 N079 IRLB8721  ; pins D G S
Q32_3 N087 N091 0 0 MMBT2222A
R6 N083 N087 300k
R7 N071 N083 49.9k
Q5 N074 N077 0 0 MMBT2222A
R8 N065 N074 1Meg
R9 N057 N065 10Meg
R10 N091 VcMENOS 20k
Vcell2 N068 N080 3.3
Q32_2 N071 N065 N057 0 MMBT2907A
X§S32 N088 N083 N080 IRLB8721  ; pins D G S
R11 N076 VcMAS 20k
R12 N077 VcMAS 20k
Rout1 N057 N067 1m
Rout2 N057 N068 1m
Q3_1 N092 N093 0 0 MMBT2222A
R13 N093 VcOFF 20k
R14 N084 N092 300K
R15 N057 N084 570K
X§S5 N088 N084 N057 AO3401A  ; pins D G S
Q1 N055 N059 0 0 MMBT2222A
R16 N051 N055 300k
R17 N039 N051 49.9k
Q3 N042 N045 0 0 MMBT2222A
R18 N033 N042 1Meg
R19 N026 N033 10Meg
R20 N059 VcMENOS 20k
Vcell3 N036 N048 3.3
Q4 N039 N033 N026 0 MMBT2907A
X§S3 N057 N051 N048 IRLB8721  ; pins D G S
Q6 N056 N060 0 0 MMBT2222A
R21 N052 N056 300k
R22 N040 N052 49.9k
Q7 N043 N046 0 0 MMBT2222A
R23 N034 N043 1Meg
R24 N026 N034 10Meg
R25 N060 VcMENOS 20k
Vcell4 N037 N049 3.3
Q8 N040 N034 N026 0 MMBT2907A
X§S4 N057 N052 N049 IRLB8721  ; pins D G S
R26 N045 VcMAS 20k
R27 N046 VcMAS 20k
Rout3 N026 N036 1m
Rout4 N026 N037 1m
Q9 N061 N062 0 0 MMBT2222A
R28 N062 VcOFF 20k
R29 N053 N061 300K
R30 N026 N053 570K
X§S6 N057 N053 N026 AO3401A  ; pins D G S
Q10 N146 N150 0 0 MMBT2222A
R31 N142 N146 300k
R32 N132 N142 49.9k
Q11 N136 N139 0 0 MMBT2222A
R33 N128 N136 1Meg
R34 N124 N128 10Meg
R35 N150 VcMENOS 20k
Vcell5 N125 0 3.3
Q12 N132 N128 N124 0 MMBT2907A
X§S7 out_neg N142 0 IRLB8721  ; pins D G S
Q13 N116 N119 0 0 MMBT2222A
R36 N112 N116 300k
R37 N100 N112 49.9k
Q14 N103 N106 0 0 MMBT2222A
R38 N094 N103 1Meg
R39 N088 N094 10Meg
R40 N119 VcON 20k
Vcell6 N097 N109 3.3
Q15 N100 N094 N088 0 MMBT2907A
X§S8 N124 N112 N109 IRLB8721  ; pins D G S
R41 N139 VcMAS 20k
R42 N106 VcOFF 20k
Rout5 N124 N125 1m
Rout6 N088 N097 1m
Q16 N085 N089 0 0 MMBT2222A
R43 N081 N085 300k
R44 N069 N081 49.9k
Q17 N072 N075 0 0 MMBT2222A
R45 N063 N072 1Meg
R46 N057 N063 10Meg
R47 N089 VcMENOS 20k
Vcell7 N066 N078 3.3
Q18 N069 N063 N057 0 MMBT2907A
X§S9 N088 N081 N078 IRLB8721  ; pins D G S
R48 N075 VcMAS 20k
Rout7 N057 N066 1m
Q19 N054 N058 0 0 MMBT2222A
R49 N050 N054 300k
R50 N038 N050 49.9k
Q20 N041 N044 0 0 MMBT2222A
R51 N032 N041 1Meg
R52 N026 N032 10Meg
R53 N058 VcMENOS 20k
Vcell8 N035 N047 3.3
Q21 N038 N032 N026 0 MMBT2907A
X§S10 N057 N050 N047 IRLB8721  ; pins D G S
R54 N044 VcMAS 20k
Rout8 N026 N035 1m
Q22 N024 N028 0 0 MMBT2222A
R55 N020 N024 300k
R56 N008 N020 49.9k
Q23 N011 N014 0 0 MMBT2222A
R57 N002 N011 1Meg
R58 out_pos N002 10Meg
R59 N028 VcMENOS 20k
Vcell9 N005 N017 3.3
Q24 N008 N002 out_pos 0 MMBT2907A
X§S13 N026 N020 N017 IRLB8721  ; pins D G S
Q25 N025 N029 0 0 MMBT2222A
R60 N021 N025 300k
R61 N009 N021 49.9k
Q26 N012 N015 0 0 MMBT2222A
R62 N003 N012 1Meg
R63 out_pos N003 10Meg
R64 N029 VcMENOS 20k
Vcell10 N006 N018 3.3
Q27 N009 N003 out_pos 0 MMBT2907A
X§S14 N026 N021 N018 IRLB8721  ; pins D G S
R65 N014 VcMAS 20k
R66 N015 VcMAS 20k
Rout9 out_pos N005 1m
Rout10 out_pos N006 1m
Q28 N030 N031 0 0 MMBT2222A
R67 N031 VcOFF 20k
R68 N022 N030 300K
R69 out_pos N022 570K
X§S15 N026 N022 out_pos AO3401A  ; pins D G S
Q29 N023 N027 0 0 MMBT2222A
R70 N019 N023 300k
R71 N007 N019 49.9k
Q30 N010 N013 0 0 MMBT2222A
R72 N001 N010 1Meg
R73 out_pos N001 10Meg
R74 N027 VcMENOS 20k
Vcell13 N004 N016 3.3
Q31 N007 N001 out_pos 0 MMBT2907A
X§S16 N026 N019 N016 IRLB8721  ; pins D G S
R75 N013 VcMAS 20k
Rout13 out_pos N004 1m
.model NPN NPN
.model PNP PNP
.lib standard.bjt
.tran 0 40m 0 10u
.MODEL MMBT2222A  NPN (IS=25.4f NF=1.00 BF=274 VAF=114
+ IKF=0.121 ISE=14.3p NE=2.00 BR=4.00 NR=1.00
+ VAR=24.0 IKR=0.300 RE=0.219 RB=0.877 RC=87.7m
+ XTB=1.5 CJE=27.6p VJE=1.10 MJE=0.500 CJC=14.2p VJC=0.300
+ MJC=0.300 TF=622p TR=124n EG=1.12 )
.MODEL MMBT2907A  PNP (IS=60.7f NF=1.00 BF=312 VAF=139
+ IKF=0.219 ISE=26.0p NE=2.00 BR=4.00 NR=1.00
+ VAR=20.0 IKR=0.540 RE=85.8m RB=0.343 RC=34.3m
+ XTB=1.5 CJE=50.4p VJE=1.10 MJE=0.500 CJC=23.1p VJC=0.300
+ MJC=0.300 TF=758p TR=123n EG=1.12 )
.model IRF530 VDMOS(Rg=3 Vto=4 Rd=50m Rs=12m Rb=60m Kp=5 lambda=.01 Cgdmax=1n Cgdmin=.26n Cgs=.2n Cjo=.4n Is=52p ksubthres=.1 mfg=International_Rectifier Vds=100 Ron=160m Qg=26n)
.model AONS32304 VDMOS(Kp=239 Rs=0.42m Rd=1.2m Rg=3.0 Vto=2.16 VtoTc=-2.8m Bex=-2.07 mtriode=1.1 Ksubthres=0.1 Lambda=0.158 Cgdmax=1420p Cgdmin=288p Cgs=5352p tt=19n A=0.7 Is=2.35E-11 N=1.017 Eg=1.07 Rb=0.1m Trb1=-1 BV=33 IBV=250u M=0.456 Vj=0.56 Cjo=1090.0pF mfg=AOS Vds=30 Ron=1.8m Qg=40n)
.inc SiDR140DP_PS.LIB
.inc AO3401A.sub
.inc IRLB8721.sub
* .op
.backanno
.end